# Altium schematic sheet V2.0.SchDoc
size 127 x 88 mm; PageSetup: Record=PageOptions|CenterHorizontal=True|CenterVertical=True|PrintScale=0.71|XCorrection=1.00|YCorrection=1.00|PrintKind=1|BorderSize=5000000|LeftOffset=0|BottomOffset=0|Orientation=2|PaperLength=1000|PaperWidth=1000|Scale=100|PaperSource=15|PrintQuality=4000|MediaType=1|DitherType=10|PrintScaleMode=1|PaperKind=A4|PaperIndex=9
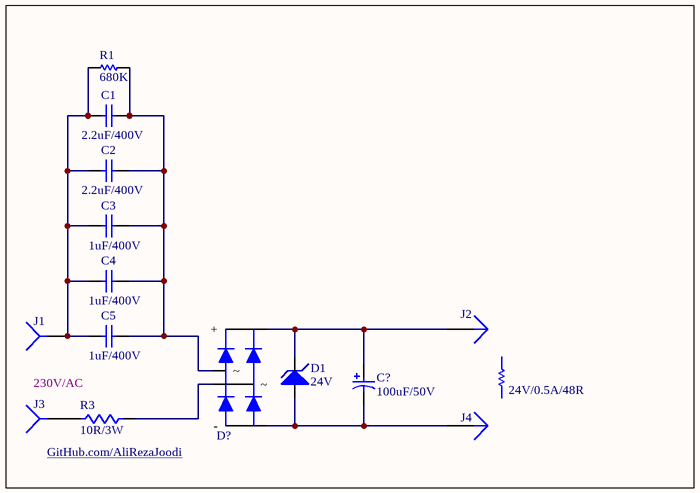
[diagram p0: V2.0.SchDoc]

## Parts
C1  2.2uF/400V  [C_THD_CER_(P5.08-D8-T3)]
C2  2.2uF/400V  [C_THD_CER_(P5.08-D8-T3)]
C3  1uF/400V  [C_THD_CER_(P5.08-D8-T3)]
C4  1uF/400V  [C_THD_CER_(P5.08-D8-T3)]
C5  1uF/400V  [C_THD_CER_(P5.08-D8-T3)]
C?  100uF/50V  [C_THD_EL_(P2.54-D6-H11)]
D1  24V
D?  Bridge  (value not drawn)
J1  1PIN  (value not drawn)
J2  1PIN  (value not drawn)
J3  1PIN  (value not drawn)
J4  1PIN  (value not drawn)
R1  680K  [R_THD_AXIAL0.4(1/4W)]
R3  10R/3W  [R_THD_AXIAL0.9(3W)]
R?  24V/0.5A/48R

## Nets
NetC1_1: C1.1 C2.1 C3.1 C4.1 C5.1 J1.1(A) R1.1
NetC1_2: C1.2 C2.2 C3.2 C4.2 C5.2 D?.2 R1.2
NetC?_1: C?.1 D1.2 D?.4(+) J2.1(A)
NetC?_2: C?.2 D1.1 D?.3(-) J4.1(A)
NetD?_1: D?.1 R3.2
NetJ3_1: J3.1(A) R3.1

## Notes on the sheet
- 230V/AC
- GitHub.com/AliRezaJoodi

## Library data of the parts
C1-C5 = Capacitor_Ceramic: Capacitor, Ceramic Multilayer; Revision: July-2002: Re-released for DXP Platform.
C? = Capacitor_Electrolytic: Capacitor, Electrolytic; Revision: July-2002: Re-released for DXP Platform.
D1 = Diode_Zener: Diode, Zener; Revision: July-2002: Re-released for DXP Platform.
D? = Diode_Bridge_2Form: Full Wave Diode Bridge; Manufacturer: Generic Components; Class I: Discrete; Class II: Rectifier - Bridge; Published: 8-Jun-2000; Revision: July-2002: Re-released for DXP Platform.; Publisher: Altium Limited
J1 J3 = Connector_Socket_1Pin_Female: Connector, Socket, 1Pin; Revision: July-2002: Re-released for DXP Platform.
J2 J4 = Connector_Socket_1Pin_Male: Connector, Socket, 1Pin; Revision: July-2002: Re-released for DXP Platform.
R1 = Resistor: Revision: July-2002: Re-released for DXP Platform.
R3 = Resistor_2Form: Resistor; Revision: July-2002: Re-released for DXP Platform.
R? = Resistor_Lable: Lable Resistor; Revision: July-2002: Re-released for DXP Platform.